# EAGLE schematic gate (EAGLE 7.2.0)
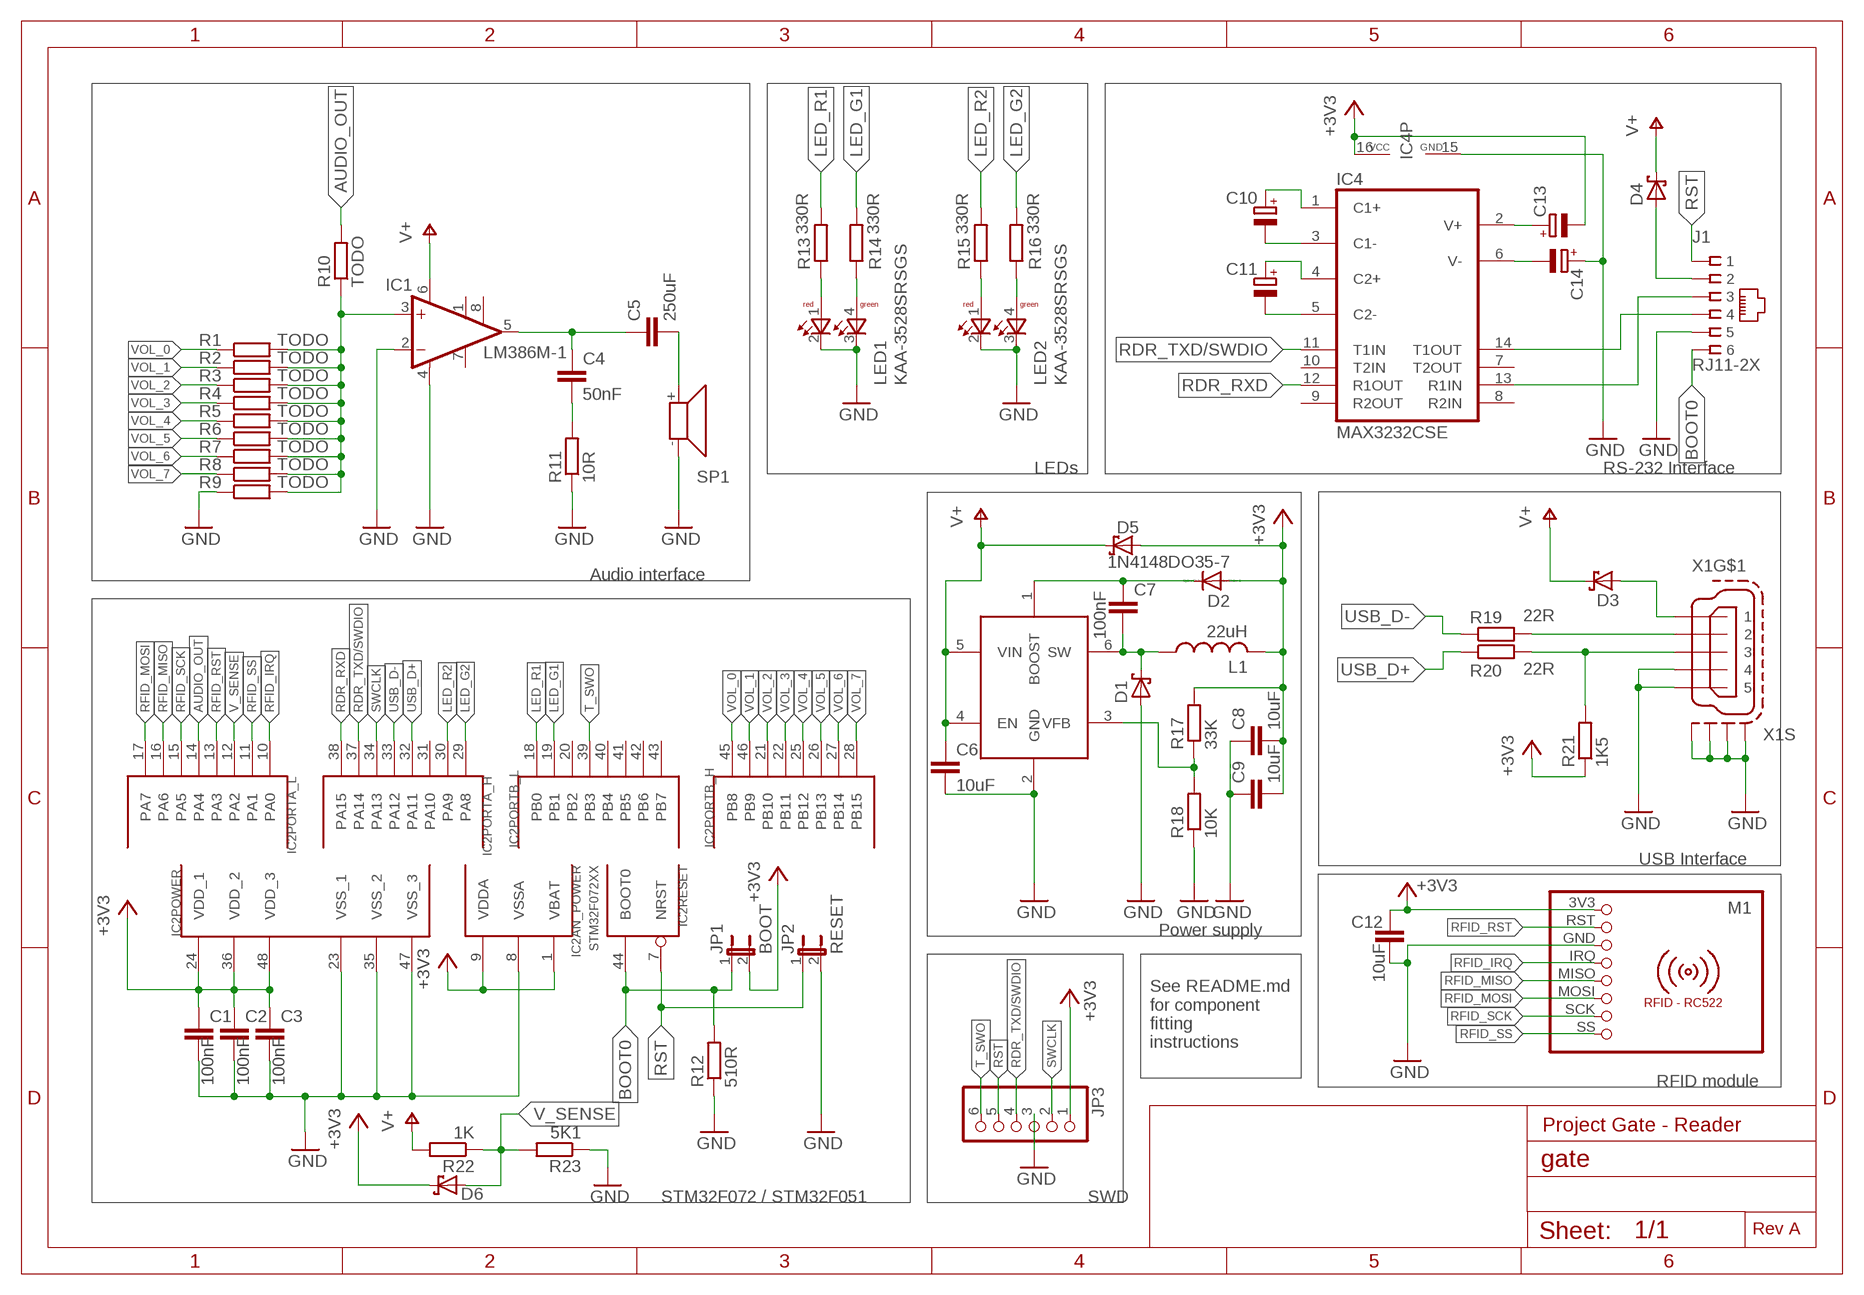
[diagram p0: schematic, sheet 1]

## Parts
C1  100nF  C-EUC0805  [C0805]
C2  100nF  C-EUC0805  [C0805]
C3  100nF  C-EUC0805  [C0805]
C4  50nF  C-EUC0805  [C0805]
C5  250uF  C-EUC0805  [C0805]
C6  10uF  C-EUC3225  [C3225]
C7  100nF  C-EUC0805  [C0805]
C8  10uF  C-EUC0805  [C0805]
C9  10uF  C-EUC0805  [C0805]
C10  CPOL-EU153CLV-0505  [153CLV-0505]
C11  CPOL-EU153CLV-0505  [153CLV-0505]
C12  10uF  C-EUC0805  [C0805]
C13  CPOL-EU153CLV-0505  [153CLV-0505]
C14  CPOL-EU153CLV-0505  [153CLV-0505]
D1  SCHOTTKY-DIODESMD  [SMB]
D2  1N4148DO35-7  [DO35-7]
D3  SCHOTTKY-DIODESMD  [SMB]
D4  SCHOTTKY-DIODESMD  [SMB]
D5  SCHOTTKY-DIODESMD  [SMB]
D6  SCHOTTKY-DIODESMD  [SMB]
IC1  LM386M-1  [SO08]
IC2  STM32F072XX  [TQFP48]
IC3  MCP16301/H  [SOT23-6]
IC4  MAX3232CSE  [SO16]
J1  RJ11-2X  [RJ11-NO_SHIELD]
JP1  BOOT  JP1E  [JP1]
JP2  RESET  JP1E  [JP1]
JP3  PINHD-1X6  [1X06]
L1  22uH  L-USPIS2816  [PIS2816]
LED1  KAA-3528SRSGS  [KAA-3528SRSGS]
LED2  KAA-3528SRSGS  [KAA-3528SRSGS]
M1  RFID-RC522  [RFID-RC522]
R1  TODO  R-EU_R0805  [R0805]
R2  TODO  R-EU_R0805  [R0805]
R3  TODO  R-EU_R0805  [R0805]
R4  TODO  R-EU_R0805  [R0805]
R5  TODO  R-EU_R0805  [R0805]
R6  TODO  R-EU_R0805  [R0805]
R7  TODO  R-EU_R0805  [R0805]
R8  TODO  R-EU_R0805  [R0805]
R9  TODO  R-EU_R0805  [R0805]
R10  TODO  R-EU_R0805  [R0805]
R11  10R  R-EU_R0805  [R0805]
R12  510R  R-EU_R0805  [R0805]
R13  330R  R-EU_R0805  [R0805]
R14  330R  R-EU_R0805  [R0805]
R15  330R  R-EU_R0805  [R0805]
R16  330R  R-EU_R0805  [R0805]
R17  33K  R-EU_R0805  [R0805]
R18  10K  R-EU_R0805  [R0805]
R19  22R  R-EU_R0805  [R0805]
R20  22R  R-EU_R0805  [R0805]
R21  1K5  R-EU_R0805  [R0805]
R22  1K  R-EU_R0805  [R0805]
R23  5K1  R-EU_R0805  [R0805]
SP1  SMS-1308MS-2-R  [SMS-1308MS-2-R]
X1  MINI-USB-SCHIELD-32005-301  [32005-301]

## Nets
+3V3: C1.1 C2.1 C3.1 C8.2 C9.2 C12.1 C13.- D2.A D5.A D6.C IC2.1(AN_POWER:VBAT) IC2.9(AN_POWER:VDDA) IC2.24(POWER:VDD_1) IC2.36(POWER:VDD_2) IC2.48(POWER:VDD_3) IC4.16(VCC) JP1.2 JP3.1 L1.2 M1.3V3 R17.2 R21.1
AUDIO_OUT: IC2.14(PORTA_L:PA4) R10.2
BOOT0: IC2.44(RESET:BOOT0) J1.6 JP1.1 R12.2
GND: C1.2 C2.2 C3.2 C6.2 C8.1 C9.1 C12.2 C14.+ D1.A IC1.2(-IN) IC1.4(GND) IC2.8(AN_POWER:VSSA) IC2.23(POWER:VSS_1) IC2.35(POWER:VSS_2) IC2.47(POWER:VSS_3) IC3.2(GND) IC4.15(GND) J1.5 JP2.2 JP3.3 LED1.2(C-RED) LED1.3(C-GREEN) LED2.2(C-RED) LED2.3(C-GREEN) M1.GND R9.1 R11.1 R12.1 R18.1 R23.1 SP1.- X1.4 X1.5 X1.M1(S:S1) X1.M2(S:S2) X1.M3(S:S3) X1.M4(S:S4)
LED_G1: IC2.19(PORTB_L:PB1) R14.2
LED_G2: IC2.29(PORTA_H:PA8) R16.2
LED_R1: IC2.18(PORTB_L:PB0) R13.2
LED_R2: IC2.30(PORTA_H:PA9) R15.2
N$1: IC4.13(R1IN) J1.3
N$2: IC4.14(T1OUT) J1.4
N$3: C10.+ IC4.1(C1+)
N$4: C10.- IC4.3(C1-)
N$5: C11.+ IC4.4(C2+)
N$6: C11.- IC4.5(C2-)
N$7: C13.+ IC4.2(V+)
N$8: C14.- IC4.6(V-)
N$9: D4.A J1.2
N$10: LED2.1(A-RED) R15.1
N$11: D3.A X1.1
N$12: R19.2 X1.2
N$13: R20.2 R21.2 X1.3
N$15: IC1.3(+IN) R1.2 R2.2 R3.2 R4.2 R5.2 R6.2 R7.2 R8.2 R9.2 R10.1
N$16: C4.1 C5.1 IC1.5(OUT)
N$17: C4.2 R11.2
N$18: C5.2 SP1.+
N$19: LED1.1(A-RED) R13.1
N$20: LED1.4(A-GREEN) R14.1
N$21: LED2.4(A-GREEN) R16.1
N$22: C7.2 D1.C IC3.6(SW) L1.1
N$23: C7.1 D2.C IC3.1(BOOST)
N$25: IC3.3(VFB) R17.1 R18.2
RDR_RXD: IC2.38(PORTA_H:PA15) IC4.12(R1OUT)
RDR_TXD/SWDIO: IC2.37(PORTA_H:PA14) IC4.11(T1IN) JP3.4
RFID_IRQ: IC2.10(PORTA_L:PA0) M1.IRQ
RFID_MISO: IC2.16(PORTA_L:PA6) M1.MISO
RFID_MOSI: IC2.17(PORTA_L:PA7) M1.MOSI
RFID_RST: IC2.13(PORTA_L:PA3) M1.RST
RFID_SCK: IC2.15(PORTA_L:PA5) M1.SCK
RFID_SS: IC2.11(PORTA_L:PA1) M1.SS
RST: IC2.7(RESET:NRST) J1.1 JP2.1 JP3.5
SWCLK: IC2.34(PORTA_H:PA13) JP3.2
T_SWO: IC2.39(PORTB_L:PB3) JP3.6
USB_D+: IC2.32(PORTA_H:PA11) R20.1
USB_D-: IC2.33(PORTA_H:PA12) R19.1
V+: C6.1 D3.C D4.C D5.C IC1.6(VS) IC3.4(EN) IC3.5(VIN) R22.2
V_SENSE: D6.A IC2.12(PORTA_L:PA2) R22.1 R23.2
VOL_0: IC2.45(PORTB_H:PB8) R1.1
VOL_1: IC2.46(PORTB_H:PB9) R2.1
VOL_2: IC2.21(PORTB_H:PB10) R3.1
VOL_3: IC2.22(PORTB_H:PB11) R4.1
VOL_4: IC2.25(PORTB_H:PB12) R5.1
VOL_5: IC2.26(PORTB_H:PB13) R6.1
VOL_6: IC2.27(PORTB_H:PB14) R7.1
VOL_7: IC2.28(PORTB_H:PB15) R8.1
Unconnected: IC1.1(GAIN) IC1.7(BYPASS) IC1.8(GAIN) IC2.2(PORTC:PC13) IC2.3(PORTC:PC14) IC2.4(PORTC:PC15) IC2.5(PORTF/OSC:PF0/OSC<=) IC2.6(PORTF/OSC:PF1/OSC=>) IC2.20(PORTB_L:PB2) IC2.31(PORTA_H:PA10) IC2.40(PORTB_L:PB4) IC2.41(PORTB_L:PB5) IC2.42(PORTB_L:PB6) IC2.43(PORTB_L:PB7) IC4.7(T2OUT) IC4.8(R2IN) IC4.9(R2OUT) IC4.10(T2IN)

## Notes on the sheet
- LEDs | RS-232 Interface
- Audio interface
- USB Interface
- Power supply
- See README.md
  for component
  fitting
  instructions
- RFID module
- Project Gate - Reader
- STM32F072 / STM32F051 | SWD
- Rev A

## Library data of the parts
C1-C9 C12 = rcl:C-EU: CAPACITOR, European symbol
C10 C11 C13 C14 = rcl:CPOL-EU: POLARIZED CAPACITOR, European symbol
D1 D3-D6 = diode:SCHOTTKY-DIODE: Schottky Diode
D2 = diode:1N4148: DIODE high speed (Philips)
IC1 = linear:LM386?-*: Low Voltage Audio Power Amplifier Source: http://cache.national.com/ds/LM/LM386.pdf
IC2 = stm32f051:STM32F072XX: ST STM32F072 48pin LQFP
IC3 = MCP16301:MCP16301/H: High-Voltage Input Integrated Switch Step-Down Regulator
IC4 = maxim:MAX3232*: True RS-232 Transceivers 3.0V to 5.5V, Low-Power up to 1Mbps, Using Four 0.1µF External Capacitors Source: http://pdfserv.maxim-ic.com/en/ds/MAX3222-MAX3241.pdf; MPN: MAX3232CSE; OC_FARNELL: 9725490; OC_NEWARK: 90C2890
J1 = con-tycoelectronics:RJ11: CORCOM Modular RJ Jacks No Shield Source: www.tycoelectronics.com .. ENG_DS_1654001_1099_RJ_L_0507.pdf; OC_FARNELL: unknown; OC_NEWARK: unknown
JP1 JP2 = jumper:JP1E: JUMPER
JP3 = pinhead:PINHD-1X6: PIN HEADER
L1 = rcl:L-US: INDUCTOR, American symbol
LED1 LED2 = kaa-3528:KAA-3528SRSGS: KINGBRIGHT ELECTRONIC KAA-3528RSGS
M1 = mfrc522-module:RFID-RC522: RFID-RC522 MFRC-522 based breakout board
R1-R23 = rcl:R-EU_: RESISTOR, European symbol
SP1 = speaker:SMS-1308MS-2-R: Speaker 13 x 13mm, 8 Ohm, 0.7W Source: pui audio inc. SMS-1308MS-2-R.pdf
X1 = con-cypressindustries:MINI-USB-SCHIELD-: MINI USB-B Conector Source: www.cypressindustries.com; OC_FARNELL: unknown; OC_NEWARK: unknown